# Altium schematic sheet 06-LogicNOT.SchDoc
size A4; DocumentNumber: 6; SheetNumber: 6; SheetTotal: 26
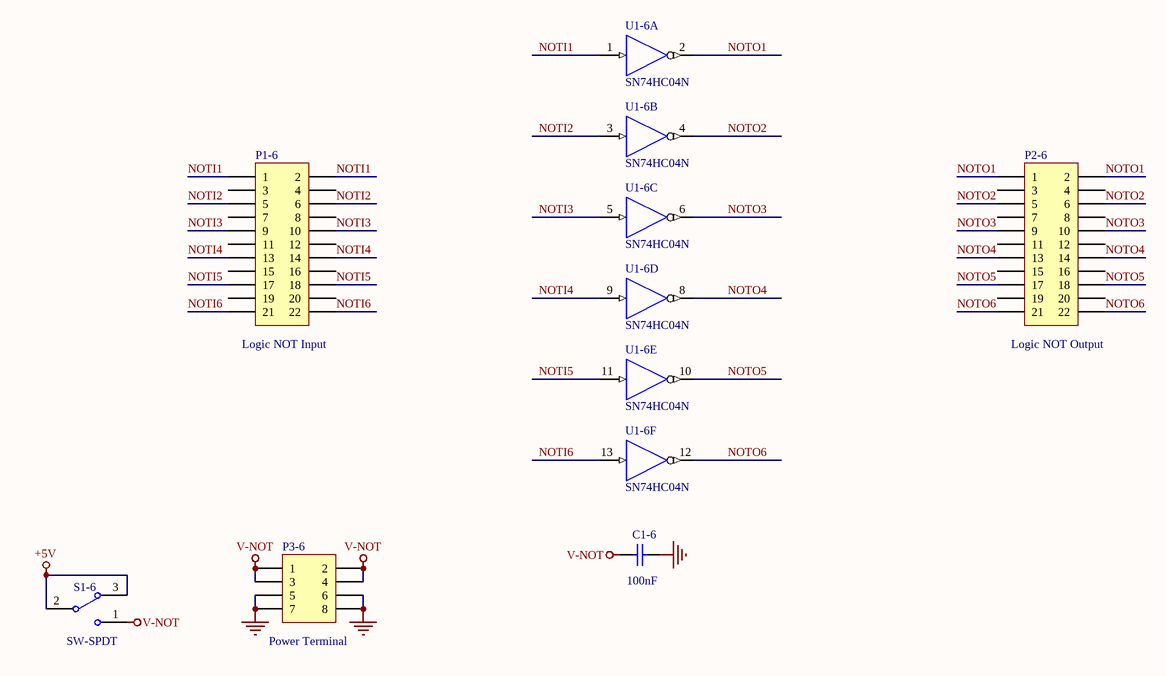
[diagram p0: 06-LogicNOT.SchDoc]

## Parts
C1-6  value 100nF  [c-0805]  (hidden comment: 104)
P1-6  value Logic NOT Input  [JP2.54-F-2x11A]  (hidden comment: Header 11X2)
P2-6  value Logic NOT Output  [JP2.54-F-2x11A]  (hidden comment: Header 11X2)
P3-6  Publisher: Power Terminal  [JP2.54-F-2x04A]  (hidden comment: Header 4X2)
S1-6  SW-SPDT  [SW-SLIDE-2P-2W]
U1-6  SN74HC04N  [SK-DIP14-300]  (parts A,B,C,D,E,F of 6)

## Nets
+5V: S1-6.2 S1-6.3
GND: C1-6.2 P3-6.5 P3-6.6 P3-6.7 P3-6.8 U1-6.7(GND)
V-NOT: C1-6.1 P3-6.1 P3-6.2 P3-6.3 P3-6.4 S1-6.1
VCC: U1-6.14(V-NOT)
NOTI1: P1-6.1 P1-6.2 U1-6.1(A)
NOTI2: P1-6.5 P1-6.6 U1-6.3(A)
NOTI3: P1-6.9 P1-6.10 U1-6.5(A)
NOTI4: P1-6.13 P1-6.14 U1-6.9(A)
NOTI5: P1-6.17 P1-6.18 U1-6.11(A)
NOTI6: P1-6.21 P1-6.22 U1-6.13(A)
NOTO1: P2-6.1 P2-6.2 U1-6.2(Y)
NOTO2: P2-6.5 P2-6.6 U1-6.4(Y)
NOTO3: P2-6.9 P2-6.10 U1-6.6(Y)
NOTO4: P2-6.13 P2-6.14 U1-6.8(Y)
NOTO5: P2-6.17 P2-6.18 U1-6.10(Y)
NOTO6: P2-6.21 P2-6.22 U1-6.12(Y)

Not connected (* = marked no-connect by the designer): P1-6 3 4 7 8 11 12 15 16 19 20; P2-6 3 4 7 8 11 12 15 16 19 20

## Library data of the parts
C1-6 = Cap: Capacitor; Published: 8-Jun-2000; LatestRevisionDate: 17-Jul-2002; LatestRevisionNote: Re-released for DXP Platform.; PackageReference: RAD-0.3; Publisher: Altium Limited; PackageDescription: Radial Cap, Thru-Hole; 2 Leads; 0.3 in Pin Spacing
P1-6 P2-6 = Header 11X2: Header, 11-Pin, Dual row; LatestRevisionDate: 17-Jul-2002; LatestRevisionNote: Re-released for DXP Platform.
P3-6 = Header 4X2: Header, 4-Pin, Dual row; LatestRevisionDate: 17-Jul-2002; LatestRevisionNote: Re-released for DXP Platform.
S1-6 = SW-SPDT: SPDT Subminiature Toggle Switch, Right Angle Mounting, Vertical Actuation; Published: 24-Mar-1999; LatestRevisionDate: 17-Dec-2003; LatestRevisionNote: Schematic revised, PCB Footprint replaced.; DatasheetVersion: 05-Dec-2000; PackageReference: TL36WW15050; Publisher: Altium Limited; PackageDescription: Switch; 4 Leads; ComponentLink1Description: Manufacturer Link; ComponentLink1URL: http://www.apem.com
U1-6 = SN74HC04N: Hex Inverter; Published: 8-Jun-2000; LatestRevisionDate: 04-Mar-2005; LatestRevisionNote: Stylized 3D Model Added.; DatasheetVersion: May-1997; PackageVersion: Oct-1995; PackageReference: N014; Publisher: Altium Limited; PackageDescription: DIP; 14 Leads; Row Spacing 7.62 mm; Pitch 2.54 mm; ComponentLink1Description: Manufacturer Link; ComponentLink1URL: http://www.ti.com/; ComponentLink2Description: Datasheet; ComponentLink2URL: http://www-s.ti.com/sc/ds/sn74hc04.pdf